# Altium schematic sheet Sch1.SchDoc
size A4
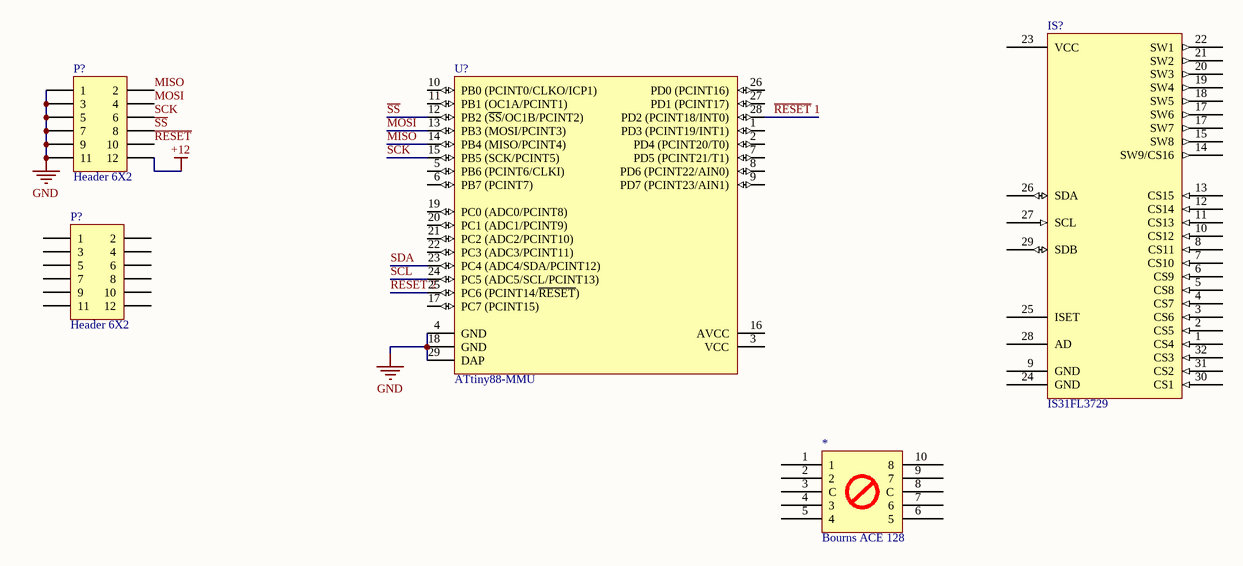
[diagram p0: Sch1.SchDoc]

## Parts
(Parts that share a designator on the sheet are numbered #1, #2 ... from top to bottom, then left to right.)
*  Bourns ACE 128  [Bourns ACE 128]
IS?  IS31FL3729  [QFN40P400X400X80_HS-33L]
P?#1  Header 6X2  [HDR2X6]
P?#2  Header 6X2  [HDR2X6]
U?  ATtiny88-MMU  [28M1_N]

## Nets
+12: P?#1.12
GND: P?#1.1 P?#1.3 P?#1.5 P?#1.7 P?#1.9 P?#1.11 U?.4(GND) U?.18(GND) U?.29(DAP)
MISO: P?#1.2 U?.14(PB4_(MISO/PCINT4))
MOSI: P?#1.4 U?.13(PB3_(MOSI/PCINT3))
~{RESET}: P?#1.10
~{RESET} 1: U?.28(PD2_(PCINT18/INT0))
~{RESET} 2: U?.25(PC6_(PCINT14/~{RESET}))
~{SS}: P?#1.8 U?.12(PB2_(~{SS}/OC1B/PCINT2))
SCK: P?#1.6 U?.15(PB5_(SCK/PCINT5))
SCL: U?.24(PC5_(ADC5/SCL/PCINT13))
SDA: U?.23(PC4_(ADC4/SDA/PCINT12))

Not connected (* = marked no-connect by the designer): * 1 2 3(C) 4(3) 5(4) 6(5) 7(6) 8(C) 9(7) 10(8); IS? 1(CS4) 2(CS5) 3(CS6) 4(CS7) 5(CS8) 6(CS9) 7(CS10) 8(CS11) 9(GND) 10(CS12) 11(CS13) 12(CS14) 13(CS15) 14(SW9/CS16) 15(SW8) 17(SW6) 18(SW5) 19(SW4) 20(SW3) 21(SW2) 22(SW1) 23(VCC) 24(GND) 25(ISET) 26(SDA) 27(SCL) 28(AD) 29(SDB) 30(CS1) 31(CS2) 32(CS3); P?#2 1 2 3 4 5 6 7 8 9 10 11 12; U? 1(PD3_(PCINT19/INT1)) 2(PD4_(PCINT20/T0)) 3(VCC) 5(PB6_(PCINT6/CLKI)) 6(PB7_(PCINT7)) 7(PD5_(PCINT21/T1)) 8(PD6_(PCINT22/AIN0)) 9(PD7_(PCINT23/AIN1)) 10(PB0_(PCINT0/CLKO/ICP1)) 11(PB1_(OC1A/PCINT1)) 16(AVCC) 17(PC7_(PCINT15)) 19(PC0_(ADC0/PCINT8)) 20(PC1_(ADC1/PCINT9)) 21(PC2_(ADC2/PCINT10)) 22(PC3_(ADC3/PCINT11)) 26(PD0_(PCINT16)) 27(PD1_(PCINT17))

## Library data of the parts
P?#1 P?#2 = Header 6X2: Header, 6-Pin, Dual row; LatestRevisionDate: 17-Jul-2002; LatestRevisionNote: Re-released for DXP Platform.; Publisher: Altium Limited
U? = ATtiny88-MMU: 8-bit AVR Microcontroller, 1.8-5.5V, 8KB Flash, 64 Bytes EEPROM, 512 Bytes SRAM, 28-pin MLF, Industrial Grade (-40°C to 85°C), Pb-Free; Published: 1-Apr-2010; DatasheetVersion: revC, Mar-2009; PackageVersion: revB, Nov-2008; PackageReference: 28M1; Publisher: Altium Limited; PackageDescription: 28-pad, 4x4x1.0mm Body, Pitch 0.45mm, 2.4x2.4mm Exposed Pad, Plastic Very Thin QFN Package (VQFN); Supplier 1: Digi-Key; Supplier Part Number 1: ATTINY88-MMU-ND; Supplier 2: Mouser; Supplier Part Number 2: 556-ATTINY88-MMU; ComponentLink1Description: Manufacturer Link; ComponentLink1URL: http://www.atmel.com/products/avr/default.asp?; ComponentLink2Description: ATtiny48/88 Datasheet; ComponentLink2URL: http://www.atmel.com/dyn/resources/prod_documents/doc8008.pdf; ComponentLink3Description: ATtiny48/88 Summary; ComponentLink3URL: http://www.atmel.com/dyn/resources/prod_documents/8008S.pdf; ComponentLink4Description: Atmel.com Home; ComponentLink4URL: http://www.atmel.com